# Altium schematic sheet 04_Pin_Headers.SchDoc
size A; SheetNumber: 5; SheetTotal: 8
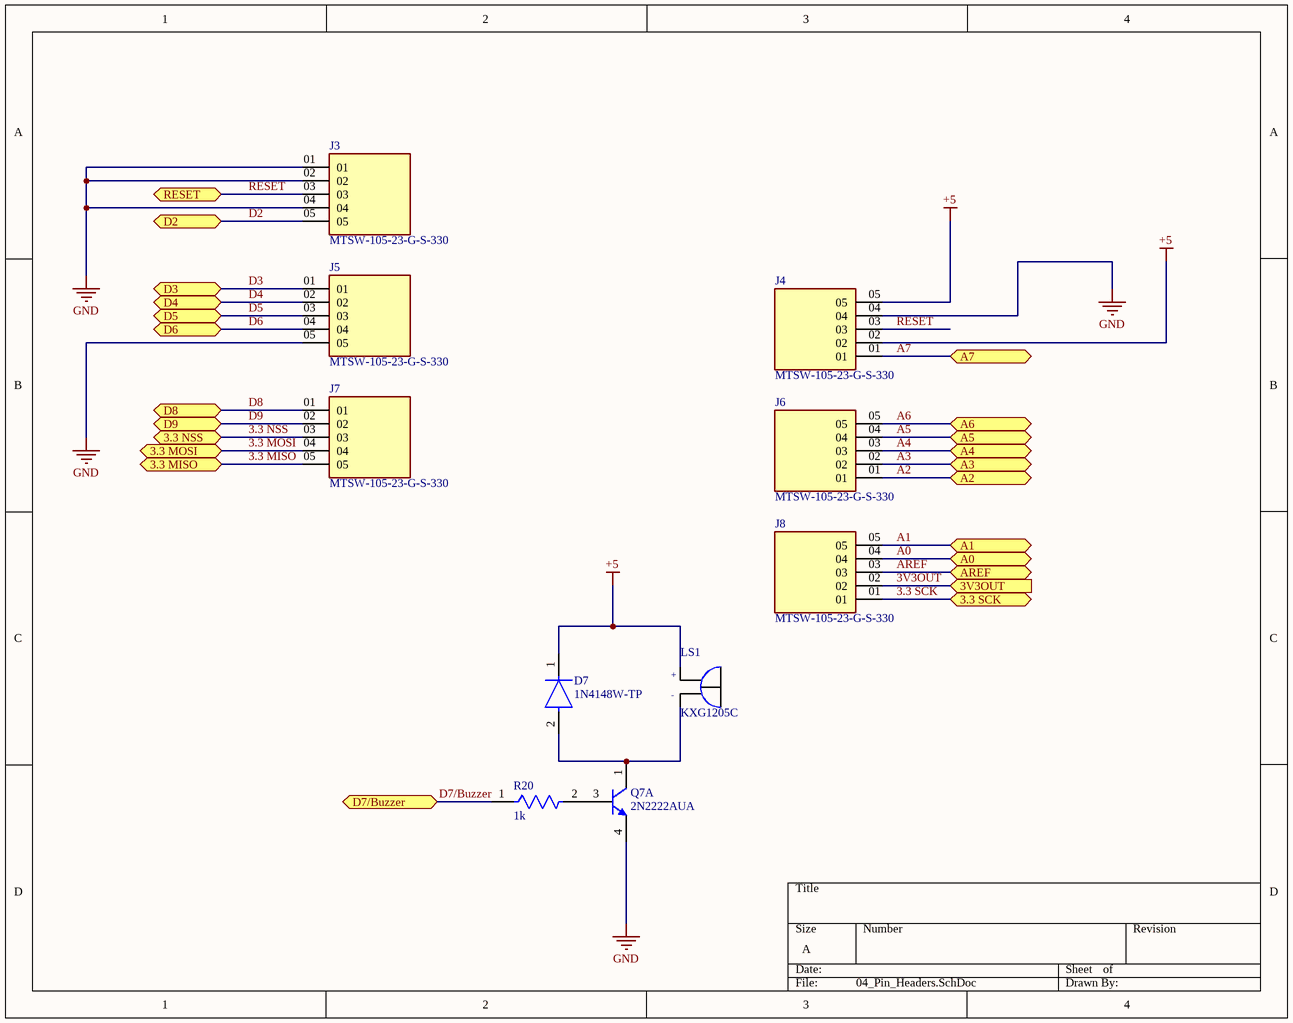
[diagram p0: 04_Pin_Headers.SchDoc]

## Parts
D7  1N4148W-TP  [FP-SOD-123-IPC_A]
J3  MTSW-105-23-G-S-330  [SAMTEC_MTSW-105-23-G-S-330]
J4  MTSW-105-23-G-S-330  [SAMTEC_MTSW-105-23-G-S-330]
J5  MTSW-105-23-G-S-330  [SAMTEC_MTSW-105-23-G-S-330]
J6  MTSW-105-23-G-S-330  [SAMTEC_MTSW-105-23-G-S-330]
J7  MTSW-105-23-G-S-330  [SAMTEC_MTSW-105-23-G-S-330]
J8  MTSW-105-23-G-S-330  [SAMTEC_MTSW-105-23-G-S-330]
LS1  KXG1205C  [*XDCR_KXG1205C_KXG1205C(Primary)]
Q7  2N2222AUA  [TT-MO-041BA-3_L]  (part A of 2)
R20  1k  [FP-TNPW1206-e3-MFG]

## Ports
3.3 MISO (bidir, see 00_Overview[1C], 06_Logic_Level_Shifters[1C]), 3.3 MOSI (bidir, see 00_Overview[1C], 06_Logic_Level_Shifters[3B]), 3.3 NSS (bidir, see 00_Overview[1C], 06_Logic_Level_Shifters[1B]), 3.3 SCK (bidir, see 00_Overview[1C], 06_Logic_Level_Shifters[3C]), 3V3OUT (in, see 00_Overview[1C], 03_Mini_USB_Circuit[1B]), A0 (bidir, see 00_Overview[2B], 01_Microcontroller_Circuit[3A]), A1 (bidir, see 00_Overview[2B], 01_Microcontroller_Circuit[3A]), A2 (bidir, see 00_Overview[2B], 01_Microcontroller_Circuit[3A]), A3 (bidir, see 00_Overview[2B], 01_Microcontroller_Circuit[3A]), A4 (bidir, see 00_Overview[2B], 01_Microcontroller_Circuit[3A]), A5 (bidir, see 00_Overview[2B], 01_Microcontroller_Circuit[3B]), A6 (bidir, see 00_Overview[2B], 01_Microcontroller_Circuit[3A]), A7 (bidir, see 00_Overview[2B], 01_Microcontroller_Circuit[3A]), AREF (bidir, see 00_Overview[2C], 01_Microcontroller_Circuit[1A]), D2 (bidir, see 00_Overview[2B], 01_Microcontroller_Circuit[3B]), D3 (bidir, see 00_Overview[2B], 01_Microcontroller_Circuit[3B]), D4 (bidir, see 00_Overview[2B], 01_Microcontroller_Circuit[3B]), D5 (bidir, see 00_Overview[2B], 01_Microcontroller_Circuit[3B]), D6 (bidir, see 00_Overview[2C], 01_Microcontroller_Circuit[3B]), D7/Buzzer (bidir, see 00_Overview[2C], 01_Microcontroller_Circuit[3B]), D8 (bidir, see 00_Overview[2C], 01_Microcontroller_Circuit[3B]), D9 (bidir, see 00_Overview[2C], 01_Microcontroller_Circuit[3B]), RESET (bidir, see 00_Overview[1B], 01_Microcontroller_Circuit[3B], 03_Mini_USB_Circuit[4B])

## Nets
+5: D7.1(C) J4.02 J4.05 LS1.P(POS)
GND: J3.01 J3.02 J3.04 J4.04 J5.05 Q7.4(E)
3.3 MISO: J7.05 ; port 3.3 MISO
3.3 MOSI: J7.04 ; port 3.3 MOSI
3.3 NSS: J7.03 ; port 3.3 NSS
3.3 SCK: J8.01 ; port 3.3 SCK
3V3OUT: J8.02 ; port 3V3OUT
A0: J8.04 ; port A0
A1: J8.05 ; port A1
A2: J6.01 ; port A2
A3: J6.02 ; port A3
A4: J6.03 ; port A4
A5: J6.04 ; port A5
A6: J6.05 ; port A6
A7: J4.01 ; port A7
AREF: J8.03 ; port AREF
D2: J3.05 ; port D2
D3: J5.01 ; port D3
D4: J5.02 ; port D4
D5: J5.03 ; port D5
D6: J5.04 ; port D6
D7/Buzzer: R20.1 ; port D7/Buzzer
D8: J7.01 ; port D8
D9: J7.02 ; port D9
RESET: J3.03 J4.03 ; port RESET
NetD7_2: D7.2(A) LS1.N(NEG) Q7.1(C)
NetQ7_3: Q7.3(B) R20.2

## Notes on the sheet
- (in symbol KXG1205C) +; -

## Library data of the parts
D7 = CMP-2000-04993-2: DIODE GEN PURP 100V 150MA SOD123; Max Reverse Leakage Current: 5uA; Max Surge Current: 2A; Reverse Recovery Time: 4ns; Polarity: Standard; Capacitance: 4pF; Max Forward Surge Current (Ifsm): 1A; Element Configuration: Single; Power Dissipation: 400mW; Forward Voltage: 1V; Radiation Hardening: No; Lead Free: Lead Free; Max Reverse Voltage (DC): 100V; Current Rating: 150mA; Forward Current: 150mA; Packaging: Tape and Reel; Number of Pins: 2; Package Quantity: 3000; Max Operating Temperature: 150°C; Min Operating Temperature: -65°C; Average Rectified Current: 150mA; Recovery Time: 4ns; Output Current: 150mA; Peak Non-Repetitive Surge Current: 2A; Width: 1.8mm; Voltage Rating (DC): 100V; Height: 1.2mm; Max Repetitive Reverse Voltage (Vrrm): 100V; Mount: Surface Mount; Length: 2.85mm
Q7 = CMP-2000-05559-1: Silicon Switching NPN Transistor, 800 mA, 50 V, -65 to 200 degC, 4-Pin LCC (MO-041BA), RoHS; Manufacturer: TT Electronics; DC Current Gain (hFE) (Min) @ Ic, Vce: 75@1mA,10V; Vce Saturation (Max) @ Ib, Ic: 1V@50mA,500mA; Current - Collector Cutoff (Max): 50nA; Current - Collector (Ic) (Max): 800mA; PCN Design/Specification: TransistorDieChange20/Jun/2014; Voltage - Collector Emitter Breakdown (Max): 50V; Power - Max: 500mW; Online Catalog: NPNTransistors; Other Names: 2N2222AUA-ND365-1563; Mounting Type: SurfaceMount; Package Description: 4-Pin Leadless Chip Carrier, Body 5.59 x 3.81 mm, Pitch 1.27 mm; Manufacturer URL: http://www.ttelectronics.com/; Datasheet Version: 08/2012; Package / Case: 4-CLCC; Package Reference: MO-041BA; Series: -; Category: DiscreteSemiconductorProducts; Transistor Type: NPN; Supplier Device Package: CeramicSMD; Packaging: Bulk; Mounting Technology: SurfaceMount; Family: Transistors(BJT)-Single; Datasheet URL: http://www.ttelectronics.com/themes/ttelectronics/datasheets/semiconductors/transistors/2N2222AUA.pdf; Frequency - Transition: -; Standard Package: 1
R20 = CMP-2003-04601-2: TNPW12061K00BEEA; NexarPartId: 42338284; Voltage Rating: 200V; Max Power Dissipation: 250mW; Tolerance: 0.1%; Resistance: 1kΩ; Temperature Coefficient: 25ppm/°C; Lead Free: Lead Free; Packaging: Cut Tape; Termination: SMD/SMT; Case Code (Imperial): 1206; Schedule B: 8533210045, 8533210045; Power Rating: 250mW; Military Standard: Not; Min Operating Temperature: -55°C; Radiation Hardening: No; Contact Plating: Tin; Composition: Thin Film; Case Code (Metric): 3216; Max Operating Temperature: 125°C; Width: 1.6002mm; Weight: 16.187578mg; Length: 3.2mm; Features: Anti-Sulfur, Automotive AEC-Q200, Moisture Resistant; REACH SVHC: Unknown; Height: 550µm; Depth: 1.6mm; RoHS: Compliant; Number of Terminations: 2; Voltage Rating (DC): 200V; Case/Package: 1206; Number of Pins: 2
J3-J8 = MTSW-105-23-G-S-330: Availability: Unavailable; Price: None; MP: MTSW-105-23-G-S-330; Package: None; Value: *
LS1 = KXG1205C: SnapEDA_Link: https://www.snapeda.com/parts/KXG1205C/Kingstate/view-part/?ref=snap; Check_prices: https://www.snapeda.com/parts/KXG1205C/Kingstate/view-part/?ref=eda; Value: *